# Altium schematic sheet RF19_Sensor_CAN_Module_Power.SchDoc
size A; DocumentNumber: 2; SheetNumber: 2; SheetTotal: 3
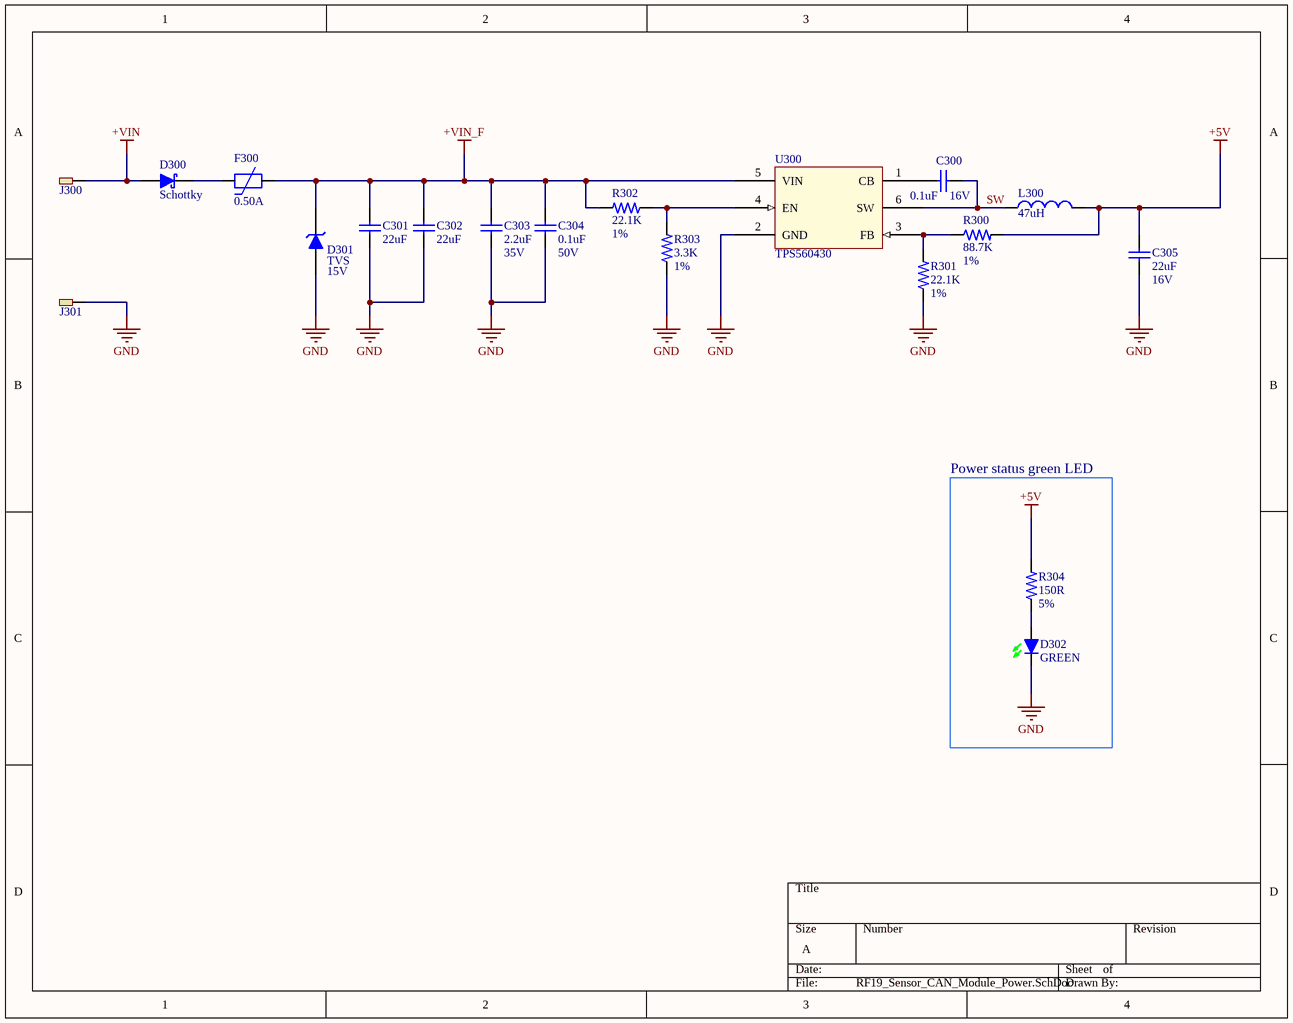
[diagram p0: RF19_Sensor_CAN_Module_Power.SchDoc]

## Parts
C300  value 0.1uF  Voltage: 16V  [C0402]  (hidden comment: C00U110P16VX5R0402)
C301  value 22uF  [C1206]  (hidden comment: CERAMIC CAP)
C302  value 22uF  [C1206]  (hidden comment: CERAMIC CAP)
C303  value 2.2uF  Voltage: 35V  [C0603]  (hidden comment: C02U210P35VX5R0603)
C304  value 0.1uF  Voltage: 50V  [C0603]  (hidden comment: CERAMIC CAP)
C305  value 22uF  Voltage: 16V  [C0805]  (hidden comment: CERAMIC CAP)
D300  Schottky  [SOD-123W]
D301  TVS  value 15V  [DO-214AC]
D302  GREEN  [0603 LED]
F300  0.50A  [PTC 1206]
J300  BREAKOUT  [BREAKOOUT PAD]  (value not drawn)  (no BOM)
J301  BREAKOUT  [BREAKOOUT PAD]  (value not drawn)  (no BOM)
L300  value 47uH  [SRN4018TA]  (hidden comment: Inductor)
R300  value 88.7K  Tolerance: 1%  [R0402]  (hidden comment: R88K710P0402063)
R301  value 22.1K  Tolerance: 1%  [R0402]  (hidden comment: R22K110P0402063)
R302  value 22.1K  Tolerance: 1%  [R0402]  (hidden comment: R22K110P0402063)
R303  value 3.3K  Tolerance: 1%  [R0402]  (hidden comment: R03K310P0402063)
R304  value 150R  Tolerance: 5%  [R0402]  (hidden comment: R150R50P0402063)
U300  TPS560430  [TI_SOP8_R-PDSO-G6]

## Blocks framed on the sheet
Power status green LED: D302 R304

## Nets
+5V: C305.1 L300.2 R300.2 R304.2
+VIN: D300.A J300.1
+VIN_F: C301.1 C302.1 C303.1 C304.1 D301.C F300.2 R302.2 U300.5(VIN)
GND: C301.2 C302.2 C303.2 C304.2 C305.2 D301.A D302.C J301.1 R301.1 R303.1 U300.2(GND)
SW: C300.1 L300.1 U300.6(SW)
NetC300_2: C300.2 U300.1(CB)
NetD300_C: D300.C F300.1
NetD302_A: D302.A R304.1
NetR300_1: R300.1 R301.2 U300.3(FB)
NetR302_1: R302.1 R303.2 U300.4(EN)

## Library data of the parts
C300 = C00U110P16VX5R0402: Ceramic cap, 0.1uF +/-10% 16V X5R 0402; Supplier 1: Mouser; Supplier 2: Digi-Key; Supplier Part Number 1: 581-0402YD104K; Supplier Part Number 2: 478-1126-1-ND
C301 C302 = CAP CERAMIC: Ceramic capacitor
C303 = C02U210P35VX5R0603: Ceramic cap, 2.2uF +/-10% 35V X5R 0603; Supplier 1: Mouser; Supplier Part Number 1: 81-GRM188R6YA225KA2D; Supplier 2: Digi-Key; Supplier Part Number 2: 490-7204-1-ND
C304 = C00U110P50VX7R0603: Ceramic cap, 0.1uF +/-10% 50V X7R 0603; Supplier 1: Mouser; Supplier Part Number 1: 80-C0603C104K5REAUTO; Supplier 2: Digi-Key; Supplier Part Number 2: 399-14105-1-ND
C305 = C022U20P16VX5R0805: Ceramic cap, 22uF +/-20% 16V X5R 0805; Supplier 1: Mouser; Supplier Part Number 1: 81-GRM219R61C226ME1K
D300 = DIODE SCHOTTKY: High speed Schottky Diode; Supplier 1: Mouser; Supplier Part Number 1: 771-PMEG6020ER-115; Supplier 2: Digi-Key; Supplier Part Number 2: 1727-5217-1-ND
D301 = DIODE TVS: TVS protection diode; Power: 1W; Supplier 1: Mouser; Supplier Part Number 1: 621-SMAJ15A-13-F; Supplier 2: Digi-Key; Supplier Part Number 2: SMAJ15A-FDICT-ND
D302 = D0603GREEN: LED Green, 0603 2.0V 20mA; ComponentLink1Description: Datasheet; ComponentLink1URL: http://optoelectronics.liteon.com/upload/download/DS22-2000-230/LTST-C191TBKT.pdf; Supplier 1: Mouser; Supplier 2: Digi-Key; Supplier Part Number 1: 859-LTST-C190KGKT; Supplier Part Number 2: 160-1435-6-ND
F300 = PTC: PTC RESETTBLE 0.50A 9V 0805; Supplier 1: Mouser; Supplier Part Number 1: 530-0ZCJ0050AF2E; Supplier 2: Digi-Key; Supplier Part Number 2: 507-1803-1-ND
J300 J301 = BREAKOUT: Breakout pad for later extension
L300 = Inductor: Code_IEC: 1005; Published: 8-Jun-2000; LatestRevisionDate: 29-May-2009; LatestRevisionNote: IPC-7351 Footprint Added.; PackageReference: 0402-A; Publisher: Altium Limited; PackageDescription: Chip Inductor; Code_JEITA: 0402; Supplier 1: Mouser; Supplier Part Number 1: 652-SRN4018TA-470M; Supplier 2: Digi-Key; Supplier Part Number 2: SRN4018TA-470MCT-ND
R300 = R88K710P0402063: Resistor 88.7K 1% 0402 1/16W; ComponentLink1Description: Datasheet; ComponentLink1URL: http://www.yageo.com/documents/recent/PYu-RC_Group_51_RoHS_L_9.pdf; Supplier 1: Mouser; Supplier Part Number 1: 603-RC0402FR-0788K7L; Supplier 2: Digi-Key; Supplier Part Number 2: 311-88.7KLRCT-ND; Supplier 3: Mouser; Supplier Part Number 3: 603-AC0402FR-0788K7L
R301 R302 = R22K110P0402063: Resistor 22.1K 1% 0402 1/16W; ComponentLink1Description: Datasheet; ComponentLink1URL: http://www.yageo.com/documents/recent/PYu-RC_Group_51_RoHS_L_9.pdf; Supplier 1: Mouser; Supplier Part Number 1: 603-RC0402FR-0722K1L; Supplier 2: Digi-Key; Supplier Part Number 2: 311-22.1KLRCT-ND
R303 = R03K310P0402063: Resistor 3.3K 1% 0402 1/16W; ComponentLink1Description: Datasheet; ComponentLink1URL: http://www.yageo.com/documents/recent/PYu-RC_Group_51_RoHS_L_9.pdf; Supplier 1: Mouser; Supplier Part Number 1: 603-RC0402FR-073K3L; Supplier 2: Digi-Key; Supplier Part Number 2: 311-3.30KLRDKR-ND
R304 = R150R50P0402063: Resistor 150R 5% 0402 1/16W; ComponentLink1Description: Datasheet; ComponentLink1URL: http://www.yageo.com/documents/recent/PYu-RC_Group_51_RoHS_L_9.pdf; Supplier 1: Mouser; Supplier 2: Digi-Key; Supplier Part Number 1: 603-RC0402JR-07150RL; Supplier Part Number 2: 311-150JRDKR-ND
U300 = TPS560430: Supplier 1: Mouser; Supplier Part Number 1: 595-TPS560430YFDBVT; Supplier 2: Digi-Key; Supplier Part Number 2: 296-50224-1-ND